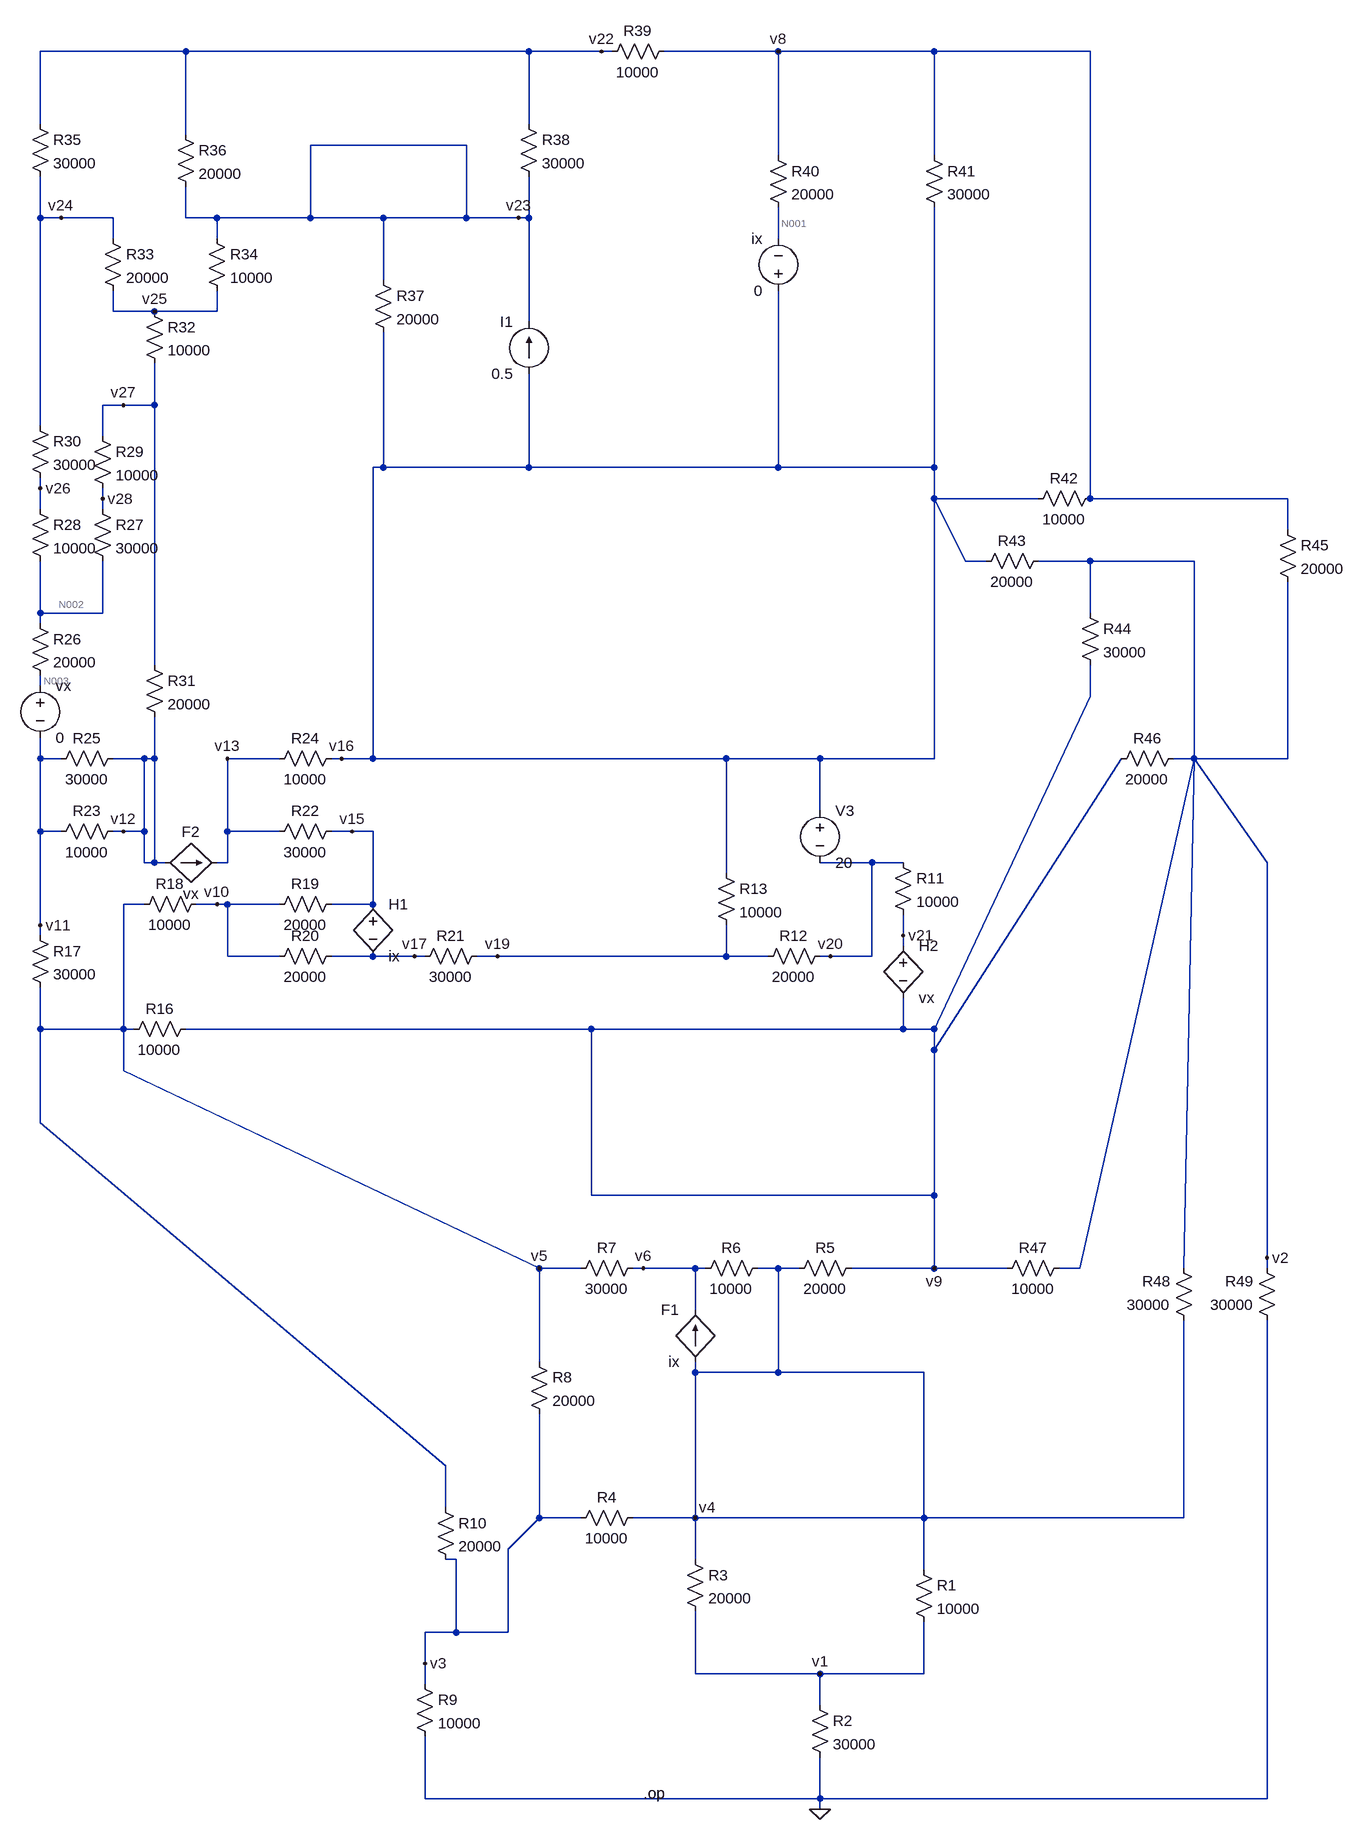
[diagram p0: schematic ejercicio 1.asc]
ejercicio 1.asc, the LTspice schematic file:
Version 4
SHEET 1 2468 1048
WIRE -48 -1696 -272 -1696
WIRE 480 -1696 -48 -1696
WIRE 592 -1696 480 -1696
WIRE 608 -1696 592 -1696
WIRE 864 -1696 688 -1696
WIRE 1104 -1696 864 -1696
WIRE 1344 -1696 1104 -1696
WIRE -272 -1584 -272 -1696
WIRE 480 -1584 480 -1696
WIRE -48 -1568 -48 -1696
WIRE 384 -1552 144 -1552
WIRE 864 -1536 864 -1696
WIRE 1104 -1536 1104 -1696
WIRE -272 -1440 -272 -1504
WIRE -240 -1440 -272 -1440
WIRE -160 -1440 -240 -1440
WIRE -48 -1440 -48 -1488
WIRE 0 -1440 -48 -1440
WIRE 144 -1440 144 -1552
WIRE 144 -1440 0 -1440
WIRE 256 -1440 144 -1440
WIRE 384 -1440 384 -1552
WIRE 384 -1440 256 -1440
WIRE 464 -1440 384 -1440
WIRE 480 -1440 480 -1504
WIRE 480 -1440 464 -1440
WIRE -160 -1408 -160 -1440
WIRE 0 -1408 0 -1440
WIRE 864 -1408 864 -1456
WIRE 256 -1344 256 -1440
WIRE -160 -1296 -160 -1328
WIRE -96 -1296 -160 -1296
WIRE 0 -1296 0 -1328
WIRE 0 -1296 -96 -1296
WIRE 480 -1280 480 -1440
WIRE -144 -1152 -176 -1152
WIRE -96 -1152 -96 -1216
WIRE -96 -1152 -144 -1152
WIRE -272 -1120 -272 -1440
WIRE -176 -1104 -176 -1152
WIRE 256 -1056 256 -1264
WIRE 256 -1056 240 -1056
WIRE 480 -1056 480 -1200
WIRE 480 -1056 256 -1056
WIRE 864 -1056 864 -1328
WIRE 864 -1056 480 -1056
WIRE 1104 -1056 1104 -1456
WIRE 1104 -1056 864 -1056
WIRE -272 -1024 -272 -1040
WIRE -176 -1008 -176 -1024
WIRE 1104 -1008 1104 -1056
WIRE 1264 -1008 1104 -1008
WIRE 1344 -1008 1344 -1696
WIRE 1648 -1008 1344 -1008
WIRE -272 -992 -272 -1024
WIRE -176 -992 -176 -1008
WIRE 1648 -960 1648 -1008
WIRE 1152 -912 1104 -1008
WIRE 1184 -912 1152 -912
WIRE 1344 -912 1264 -912
WIRE 1504 -912 1344 -912
WIRE -272 -832 -272 -912
WIRE -176 -832 -176 -912
WIRE -176 -832 -272 -832
WIRE 1344 -832 1344 -912
WIRE -272 -816 -272 -832
WIRE -96 -752 -96 -1152
WIRE -272 -720 -272 -736
WIRE 1344 -704 1344 -752
WIRE -272 -608 -272 -640
WIRE -240 -608 -272 -608
WIRE -112 -608 -160 -608
WIRE -96 -608 -96 -672
WIRE -96 -608 -112 -608
WIRE 96 -608 16 -608
WIRE 192 -608 176 -608
WIRE 240 -608 240 -1056
WIRE 240 -608 192 -608
WIRE 784 -608 240 -608
WIRE 928 -608 784 -608
WIRE 1104 -608 1104 -1008
WIRE 1104 -608 928 -608
WIRE 1504 -608 1504 -912
WIRE 1504 -608 1472 -608
WIRE 1648 -608 1648 -880
WIRE 1648 -608 1504 -608
WIRE 928 -528 928 -608
WIRE -272 -496 -272 -608
WIRE -240 -496 -272 -496
WIRE -144 -496 -160 -496
WIRE -112 -496 -112 -608
WIRE -112 -496 -144 -496
WIRE 16 -496 16 -608
WIRE 96 -496 16 -496
WIRE 208 -496 176 -496
WIRE 240 -496 208 -496
WIRE -112 -448 -112 -496
WIRE -96 -448 -96 -608
WIRE -96 -448 -112 -448
WIRE -80 -448 -96 -448
WIRE 16 -448 16 -496
WIRE 16 -448 0 -448
WIRE 1008 -448 928 -448
WIRE 1056 -448 1008 -448
WIRE 1616 -448 1504 -608
WIRE 784 -432 784 -608
WIRE -112 -384 -144 -384
WIRE 0 -384 -32 -384
WIRE 16 -384 0 -384
WIRE 96 -384 16 -384
WIRE 240 -384 240 -496
WIRE 240 -384 176 -384
WIRE -272 -352 -272 -496
WIRE -272 -336 -272 -352
WIRE 1056 -336 1056 -368
WIRE 1056 -320 1056 -336
WIRE 16 -304 16 -384
WIRE 96 -304 16 -304
WIRE 240 -304 176 -304
WIRE 304 -304 240 -304
WIRE 320 -304 304 -304
WIRE 432 -304 400 -304
WIRE 784 -304 784 -352
WIRE 784 -304 432 -304
WIRE 848 -304 784 -304
WIRE 944 -304 928 -304
WIRE 1008 -304 1008 -448
WIRE 1008 -304 944 -304
WIRE -272 -192 -272 -256
WIRE -144 -192 -144 -384
WIRE -144 -192 -272 -192
WIRE -128 -192 -144 -192
WIRE 576 -192 -48 -192
WIRE 1056 -192 1056 -240
WIRE 1056 -192 576 -192
WIRE 1104 -192 1344 -704
WIRE 1104 -192 1056 -192
WIRE 1104 -160 1392 -608
WIRE 1104 -160 1104 -192
WIRE -144 -128 -144 -192
WIRE -272 -48 -272 -192
WIRE 576 64 576 -192
WIRE 1104 64 1104 -160
WIRE 1104 64 576 64
WIRE 1616 160 1616 -448
WIRE 496 176 -144 -128
WIRE 560 176 496 176
WIRE 656 176 640 176
WIRE 736 176 656 176
WIRE 752 176 736 176
WIRE 864 176 832 176
WIRE 896 176 864 176
WIRE 1104 176 1104 64
WIRE 1104 176 976 176
WIRE 1216 176 1104 176
WIRE 1328 176 1504 -608
WIRE 1328 176 1296 176
WIRE 1488 176 1504 -608
WIRE 1616 176 1616 160
WIRE 736 240 736 176
WIRE 496 320 496 176
WIRE 736 336 736 320
WIRE 864 336 864 176
WIRE 864 336 736 336
WIRE 1088 336 864 336
WIRE 352 480 -272 -48
WIRE 352 544 352 480
WIRE 496 560 496 400
WIRE 560 560 496 560
WIRE 736 560 736 336
WIRE 736 560 640 560
WIRE 1088 560 1088 336
WIRE 1088 560 736 560
WIRE 1488 560 1488 256
WIRE 1488 560 1088 560
WIRE 448 608 496 560
WIRE 368 624 352 624
WIRE 736 624 736 560
WIRE 1088 640 1088 560
WIRE 368 736 368 624
WIRE 368 736 320 736
WIRE 448 736 448 608
WIRE 448 736 368 736
WIRE 320 784 320 736
WIRE 736 800 736 704
WIRE 928 800 736 800
WIRE 1088 800 1088 720
WIRE 1088 800 928 800
WIRE 320 816 320 784
WIRE 928 848 928 800
WIRE 320 992 320 896
WIRE 928 992 928 928
WIRE 928 992 320 992
WIRE 1616 992 1616 256
WIRE 1616 992 928 992
WIRE 928 1008 928 992
FLAG 928 1008 0
FLAG 928 800 v1
FLAG 320 784 v3
FLAG 1616 160 v2
FLAG 736 560 v4
FLAG 496 176 v5
FLAG 656 176 v6
FLAG 1104 176 v9
FLAG 0 -384 v10
FLAG -272 -352 v11
FLAG -144 -496 v12
FLAG 16 -608 v13
FLAG 208 -496 v15
FLAG 192 -608 v16
FLAG 304 -304 v17
FLAG 432 -304 v19
FLAG 944 -304 v20
FLAG 1056 -336 v21
FLAG 864 -1696 v8
FLAG 592 -1696 v22
FLAG 464 -1440 v23
FLAG -240 -1440 v24
FLAG -96 -1296 v25
FLAG -272 -1024 v26
FLAG -176 -1008 v28
FLAG -144 -1152 v27
SYMBOL res -32 -208 R90
WINDOW 0 0 56 VBottom 2
WINDOW 3 32 56 VTop 2
SYMATTR InstName R16
SYMATTR Value 10000
SYMBOL res -288 -352 R0
SYMATTR InstName R17
SYMATTR Value 30000
SYMBOL res -16 -400 R90
WINDOW 0 0 56 VBottom 2
WINDOW 3 32 56 VTop 2
SYMATTR InstName R18
SYMATTR Value 10000
SYMBOL res 192 -400 R90
WINDOW 0 0 56 VBottom 2
WINDOW 3 32 56 VTop 2
SYMATTR InstName R19
SYMATTR Value 20000
SYMBOL res 192 -320 R90
WINDOW 0 0 56 VBottom 2
WINDOW 3 32 56 VTop 2
SYMATTR InstName R20
SYMATTR Value 20000
SYMBOL h 240 -400 R0
SYMATTR InstName H1
SYMATTR Value ix
SYMATTR Value2 6
SYMBOL res 416 -320 R90
WINDOW 0 0 56 VBottom 2
WINDOW 3 32 56 VTop 2
SYMATTR InstName R21
SYMATTR Value 30000
SYMBOL res 192 -512 R90
WINDOW 0 0 56 VBottom 2
WINDOW 3 32 56 VTop 2
SYMATTR InstName R22
SYMATTR Value 30000
SYMBOL res -144 -512 R90
WINDOW 0 0 56 VBottom 2
WINDOW 3 32 56 VTop 2
SYMATTR InstName R23
SYMATTR Value 10000
SYMBOL f -80 -448 R270
WINDOW 0 32 40 VTop 2
WINDOW 3 -32 40 VBottom 2
SYMATTR InstName F2
SYMATTR Value vx
SYMATTR Value2 2000
SYMBOL res 192 -624 R90
WINDOW 0 0 56 VBottom 2
WINDOW 3 32 56 VTop 2
SYMATTR InstName R24
SYMATTR Value 10000
SYMBOL res -144 -624 R90
WINDOW 0 0 56 VBottom 2
WINDOW 3 32 56 VTop 2
SYMATTR InstName R25
SYMATTR Value 30000
SYMBOL voltage -272 -736 R0
SYMATTR InstName vx
SYMATTR Value 0
SYMBOL res -288 -832 R0
SYMATTR InstName R26
SYMATTR Value 20000
SYMBOL res -192 -1008 R0
SYMATTR InstName R27
SYMATTR Value 30000
SYMBOL res -288 -1008 R0
SYMATTR InstName R28
SYMATTR Value 10000
SYMBOL res -192 -1120 R0
SYMATTR InstName R29
SYMATTR Value 10000
SYMBOL res -288 -1136 R0
SYMATTR InstName R30
SYMATTR Value 30000
SYMBOL res -112 -768 R0
SYMATTR InstName R31
SYMATTR Value 20000
SYMBOL res -112 -1312 R0
SYMATTR InstName R32
SYMATTR Value 10000
SYMBOL res -176 -1424 R0
SYMATTR InstName R33
SYMATTR Value 20000
SYMBOL res -16 -1424 R0
SYMATTR InstName R34
SYMATTR Value 10000
SYMBOL res -288 -1600 R0
SYMATTR InstName R35
SYMATTR Value 30000
SYMBOL res -64 -1584 R0
SYMATTR InstName R36
SYMATTR Value 20000
SYMBOL res 240 -1360 R0
SYMATTR InstName R37
SYMATTR Value 20000
SYMBOL res 464 -1600 R0
SYMATTR InstName R38
SYMATTR Value 30000
SYMBOL current 480 -1200 R180
WINDOW 0 24 80 Left 2
WINDOW 3 24 0 Left 2
SYMATTR InstName I1
SYMATTR Value 0.5
SYMBOL res 704 -1712 R90
WINDOW 0 0 56 VBottom 2
WINDOW 3 32 56 VTop 2
SYMATTR InstName R39
SYMATTR Value 10000
SYMBOL res 848 -1552 R0
SYMATTR InstName R40
SYMATTR Value 20000
SYMBOL voltage 864 -1312 R180
WINDOW 0 24 96 Left 2
WINDOW 3 24 16 Left 2
SYMATTR InstName ix
SYMATTR Value 0
SYMBOL res 1088 -1552 R0
SYMATTR InstName R41
SYMATTR Value 30000
SYMBOL res 1360 -1024 R90
WINDOW 0 0 56 VBottom 2
WINDOW 3 32 56 VTop 2
SYMATTR InstName R42
SYMATTR Value 10000
SYMBOL res 1280 -928 R90
WINDOW 0 0 56 VBottom 2
WINDOW 3 32 56 VTop 2
SYMATTR InstName R43
SYMATTR Value 20000
SYMBOL res 1328 -848 R0
SYMATTR InstName R44
SYMATTR Value 30000
SYMBOL res 1632 -976 R0
SYMATTR InstName R45
SYMATTR Value 20000
SYMBOL res 1488 -624 R90
WINDOW 0 0 56 VBottom 2
WINDOW 3 32 56 VTop 2
SYMATTR InstName R46
SYMATTR Value 20000
SYMBOL res 1312 160 R90
WINDOW 0 0 56 VBottom 2
WINDOW 3 32 56 VTop 2
SYMATTR InstName R47
SYMATTR Value 10000
SYMBOL res 1504 272 R180
WINDOW 0 36 76 Left 2
WINDOW 3 36 40 Left 2
SYMATTR InstName R48
SYMATTR Value 30000
SYMBOL res 1632 272 R180
WINDOW 0 36 76 Left 2
WINDOW 3 36 40 Left 2
SYMATTR InstName R49
SYMATTR Value 30000
SYMBOL res 1072 624 R0
SYMATTR InstName R1
SYMATTR Value 10000
SYMBOL res 912 832 R0
SYMATTR InstName R2
SYMATTR Value 30000
SYMBOL res 720 608 R0
SYMATTR InstName R3
SYMATTR Value 20000
SYMBOL res 656 544 R90
WINDOW 0 0 56 VBottom 2
WINDOW 3 32 56 VTop 2
SYMATTR InstName R4
SYMATTR Value 10000
SYMBOL res 992 160 R90
WINDOW 0 0 56 VBottom 2
WINDOW 3 32 56 VTop 2
SYMATTR InstName R5
SYMATTR Value 20000
SYMBOL f 736 320 R180
WINDOW 0 24 80 Left 2
WINDOW 3 24 0 Left 2
SYMATTR InstName F1
SYMATTR Value ix
SYMATTR Value2 1.2
SYMBOL res 848 160 R90
WINDOW 0 0 56 VBottom 2
WINDOW 3 32 56 VTop 2
SYMATTR InstName R6
SYMATTR Value 10000
SYMBOL res 656 160 R90
WINDOW 0 0 56 VBottom 2
WINDOW 3 32 56 VTop 2
SYMATTR InstName R7
SYMATTR Value 30000
SYMBOL res 480 304 R0
SYMATTR InstName R8
SYMATTR Value 20000
SYMBOL res 304 800 R0
SYMATTR InstName R9
SYMATTR Value 10000
SYMBOL res 336 528 R0
SYMATTR InstName R10
SYMATTR Value 20000
SYMBOL h 1056 -336 R0
SYMATTR InstName H2
SYMATTR Value vx
SYMATTR Value2 40000
SYMBOL res 1040 -464 R0
SYMATTR InstName R11
SYMATTR Value 10000
SYMBOL voltage 928 -544 R0
SYMATTR InstName V3
SYMATTR Value 20
SYMBOL res 944 -320 R90
WINDOW 0 0 56 VBottom 2
WINDOW 3 32 56 VTop 2
SYMATTR InstName R12
SYMATTR Value 20000
SYMBOL res 768 -448 R0
SYMATTR InstName R13
SYMATTR Value 10000
TEXT 656 984 Left 2 !.op

The netlist it stands for:
* ejercicio 1.asc
R16 v9 v5 10000
R17 v11 v5 30000
R18 v10 v5 10000
R19 v15 v10 20000
R20 v17 v10 20000
H1 v15 v17 ix 6
R21 v19 v17 30000
R22 v15 v13 30000
R23 v12 v11 10000
F2 v12 v13 vx 2000
R24 v16 v13 10000
R25 v12 v11 30000
vx N003 v11 0
R26 N002 N003 20000
R27 v28 N002 30000
R28 v26 N002 10000
R29 v27 v28 10000
R30 v24 v26 30000
R31 v27 v12 20000
R32 v25 v27 10000
R33 v24 v25 20000
R34 v23 v25 10000
R35 v22 v24 30000
R36 v22 v23 20000
R37 v23 v16 20000
R38 v22 v23 30000
I1 v16 v23 0.5
R39 v8 v22 10000
R40 v8 N001 20000
V§ix v16 N001 0
R41 v8 v16 30000
R42 v8 v16 10000
R43 v2 v16 20000
R44 v2 v9 30000
R45 v8 v2 20000
R46 v2 v9 20000
R47 v2 v9 10000
R48 v4 v2 30000
R49 0 v2 30000
R1 v4 v1 10000
R2 v1 0 30000
R3 v4 v1 20000
R4 v4 v3 10000
R5 v9 v4 20000
F1 v4 v6 ix 1.2
R6 v4 v6 10000
R7 v6 v5 30000
R8 v5 v3 20000
R9 v3 0 10000
R10 v5 v3 20000
H2 v21 v9 vx 40000
R11 v20 v21 10000
V3 v16 v20 20
R12 v20 v19 20000
R13 v16 v19 10000
.op
.backanno
.end

* Results of the author's LTspice run, read from the files saved beside the schematic
* Operating Point:
*   V(v9) = -299 V
*   V(v5) = 217.7 V
*   V(v11) = 4.409 kV
*   V(v10) = -304.5 V
*   V(v15) = -826.8 V
*   V(v17) = -826.5 V
*   V(v19) = -982 V
*   V(v13) = -2.238 kV
*   V(v12) = 5.457 kV
*   V(v16) = -1.01 kV
*   V(n003) = 4.409 kV
*   V(n002) = 4.407 kV
*   V(v28) = 4.744 kV
*   V(v26) = 4.294 kV
*   V(v27) = 4.856 kV
*   V(v24) = 3.955 kV
*   V(v25) = 4.668 kV
*   V(v23) = 4.836 kV
*   V(v22) = 2.546 kV
*   V(v8) = 167.1 V
*   V(n001) = -1.01 kV
*   V(v2) = -274.1 V
*   V(v4) = 30.99 V
*   V(v1) = 25.36 V
*   V(v3) = 82.91 V
*   V(v6) = -452 V
*   V(v21) = -302.4 V
*   V(v20) = -1.03 kV
*   I(F1) = -70.62 mA
*   I(F2) = -169.8 mA
*   I(H2) = -72.75 mA
*   I(H1) = -20.92 mA
*   I(I1) = 500 mA
*   I(R13) = -2.789 mA
*   I(R12) = -2.395 mA
*   I(R11) = -72.75 mA
*   I(R10) = 6.741 mA
*   I(R9) = 8.291 mA
*   I(R8) = 6.741 mA
*   I(R7) = -22.32 mA
*   I(R6) = 48.3 mA
*   I(R5) = -16.5 mA
*   I(R4) = -5.191 mA
*   I(R3) = 281.7 µA
*   I(R2) = 845.2 µA
*   I(R1) = 563.5 µA
*   I(R49) = 9.136 mA
*   I(R48) = 10.17 mA
*   I(R47) = 2.494 mA
*   I(R46) = 1.247 mA
*   I(R45) = 22.06 mA
*   I(R44) = 831.5 µA
*   I(R43) = 36.79 mA
*   I(R42) = 117.7 mA
*   I(R41) = 39.23 mA
*   I(R40) = 58.85 mA
*   I(R39) = -237.8 mA
*   I(R38) = -76.35 mA
*   I(R37) = 292.3 mA
*   I(R36) = -114.5 mA
*   I(R35) = -46.97 mA
*   I(R34) = 16.83 mA
*   I(R33) = -35.66 mA
*   I(R32) = -18.83 mA
*   I(R31) = -30.05 mA
*   I(R30) = -11.31 mA
*   I(R29) = 11.23 mA
*   I(R28) = -11.31 mA
*   I(R27) = 11.23 mA
*   I(R26) = -84.92 µA
*   I(R25) = 34.95 mA
*   I(R24) = 122.8 mA
*   I(R23) = 104.8 mA
*   I(R22) = 47.04 mA
*   I(R21) = -5.184 mA
*   I(R20) = -26.1 mA
*   I(R19) = -26.12 mA
*   I(R18) = -52.22 mA
*   I(R17) = 139.7 mA
*   I(R16) = -51.67 mA
*   I(V3) = -75.14 mA
*   I(Ix) = -58.85 mA
*   I(Vx) = -84.92 µA